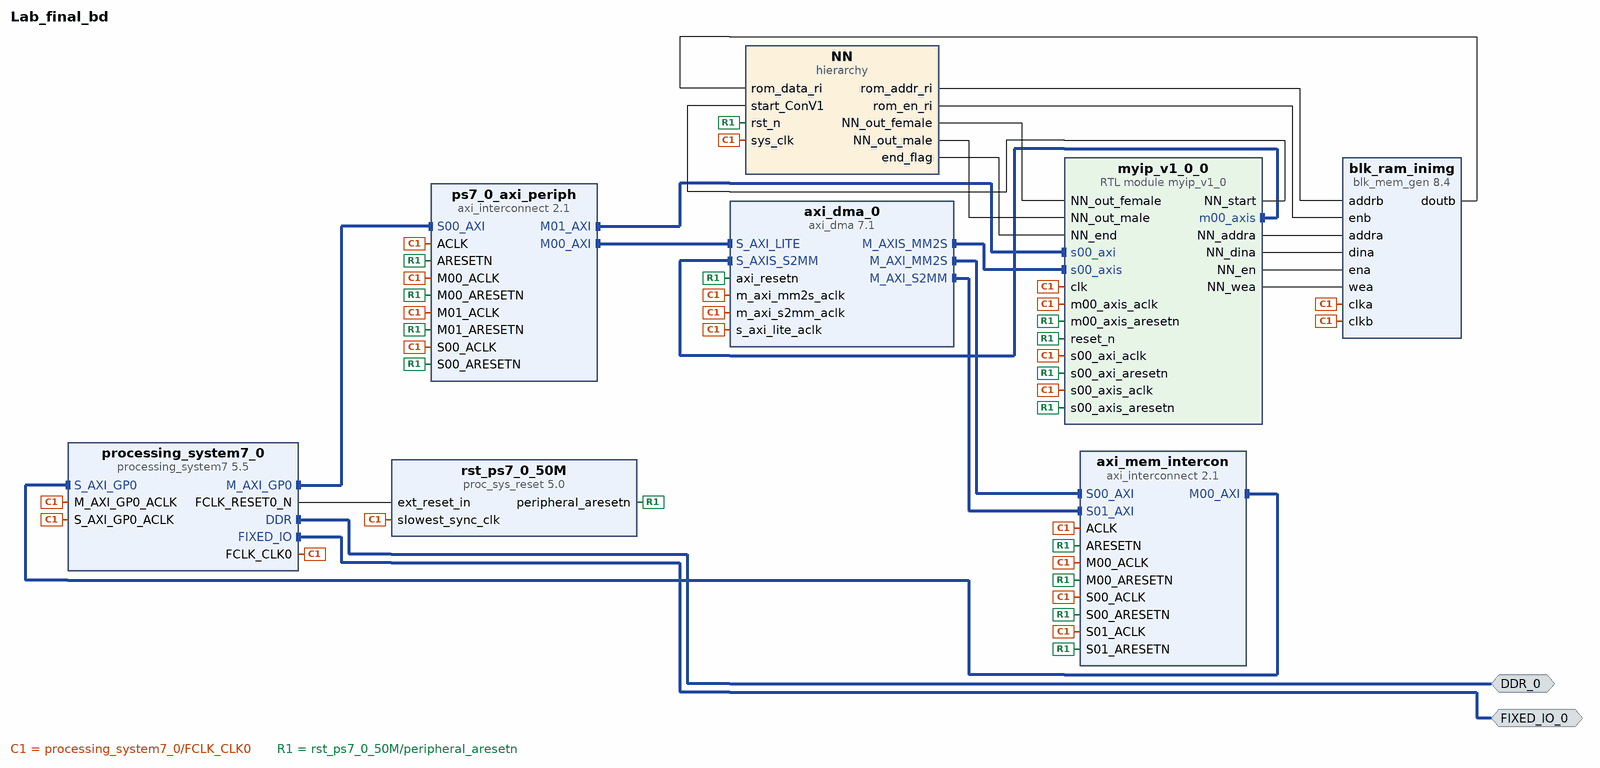
[diagram p0: block diagram of the top level]
# Vivado block design Lab_final_bd, xc7z020clg400-1, Vivado 2021.2
create_bd_design Lab_final_bd

create_bd_intf_port -mode Master -vlnv xilinx.com:interface:ddrx_rtl:1.0 DDR_0
create_bd_intf_port -mode Master -vlnv xilinx.com:display_processing_system7:fixedio_rtl:1.0 FIXED_IO_0

create_bd_cell -type ip -vlnv xilinx.com:ip:axi_dma:7.1 axi_dma_0
set_property -dict {CONFIG.c_include_sg 0} [get_bd_cells axi_dma_0]
create_bd_cell -type ip -vlnv xilinx.com:ip:axi_interconnect:2.1 axi_mem_intercon
set_property -dict {CONFIG.NUM_MI 1 CONFIG.NUM_SI 2} [get_bd_cells axi_mem_intercon]
create_bd_cell -type ip -vlnv xilinx.com:ip:blk_mem_gen:8.4 blk_ram_inimg
set_property -dict [list \
  CONFIG.Enable_32bit_Address false \
  CONFIG.Enable_A Use_ENA_Pin \
  CONFIG.Enable_B Use_ENB_Pin \
  CONFIG.Memory_Type Simple_Dual_Port_RAM \
  CONFIG.Operating_Mode_A NO_CHANGE \
  CONFIG.Port_B_Clock 100 \
  CONFIG.Port_B_Enable_Rate 100 \
  CONFIG.Read_Width_B 8 \
  CONFIG.Register_PortB_Output_of_Memory_Primitives true \
  CONFIG.Use_Byte_Write_Enable false \
  CONFIG.Write_Depth_A 4096 \
  CONFIG.Write_Width_A 8 \
  CONFIG.Write_Width_B 8 \
  CONFIG.use_bram_block Stand_Alone \
] [get_bd_cells blk_ram_inimg]
create_bd_cell -type module -reference myip_v1_0 myip_v1_0_0
create_bd_cell -type ip -vlnv xilinx.com:ip:processing_system7:5.5 processing_system7_0
set_property -dict [list \
  CONFIG.PCW_APU_PERIPHERAL_FREQMHZ 666.666666 \
  CONFIG.PCW_CRYSTAL_PERIPHERAL_FREQMHZ 33 \
  CONFIG.PCW_ENET0_PERIPHERAL_ENABLE 0 \
  CONFIG.PCW_FPGA0_PERIPHERAL_FREQMHZ 95 \
  CONFIG.PCW_FPGA1_PERIPHERAL_FREQMHZ 50 \
  CONFIG.PCW_GPIO_MIO_GPIO_ENABLE 0 \
  CONFIG.PCW_PERIPHERAL_BOARD_PRESET None \
  CONFIG.PCW_PRESET_BANK1_VOLTAGE {LVCMOS 1.8V} \
  CONFIG.PCW_QSPI_PERIPHERAL_ENABLE 0 \
  CONFIG.PCW_SD0_PERIPHERAL_ENABLE 0 \
  CONFIG.PCW_UART1_PERIPHERAL_ENABLE 0 \
  CONFIG.PCW_UIPARAM_DDR_FREQ_MHZ 533.333333 \
  CONFIG.PCW_UIPARAM_DDR_PARTNO {MT41J128M8 JP-125} \
  CONFIG.PCW_USB0_PERIPHERAL_ENABLE 0 \
  CONFIG.PCW_USE_S_AXI_GP0 1 \
] [get_bd_cells processing_system7_0]
# 333 more settings of processing_system7_0 are not shown: defaults, MIO pin electricals, DDR timing, and values the tool derives
create_bd_cell -type ip -vlnv xilinx.com:ip:axi_interconnect:2.1 ps7_0_axi_periph
set_property -dict {CONFIG.NUM_MI 2} [get_bd_cells ps7_0_axi_periph]
create_bd_cell -type ip -vlnv xilinx.com:ip:proc_sys_reset:5.0 rst_ps7_0_50M
create_bd_cell -type hier NN

# ---- hierarchy /NN ----
current_bd_instance /NN
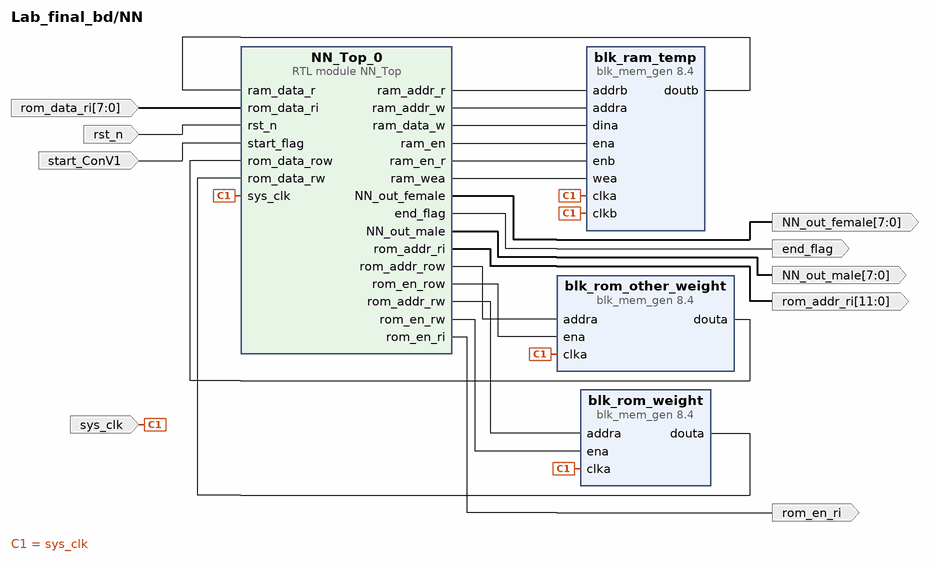
[diagram p1: block diagram inside /NN]
create_bd_pin -dir I start_ConV1
create_bd_pin -dir I sys_clk
create_bd_pin -dir I rst_n
create_bd_pin -dir O -from 7 -to 0 NN_out_male
create_bd_pin -dir O -from 7 -to 0 NN_out_female
create_bd_pin -dir I -from 7 -to 0 rom_data_ri
create_bd_pin -dir O -from 11 -to 0 rom_addr_ri
create_bd_pin -dir O rom_en_ri
create_bd_pin -dir O end_flag

create_bd_cell -type ip -vlnv xilinx.com:ip:blk_mem_gen:8.4 blk_ram_temp
set_property -dict [list \
  CONFIG.Enable_32bit_Address false \
  CONFIG.Enable_B Use_ENB_Pin \
  CONFIG.Memory_Type Simple_Dual_Port_RAM \
  CONFIG.Operating_Mode_A NO_CHANGE \
  CONFIG.Port_B_Clock 100 \
  CONFIG.Port_B_Enable_Rate 100 \
  CONFIG.Read_Width_B 8 \
  CONFIG.Register_PortB_Output_of_Memory_Primitives true \
  CONFIG.Use_Byte_Write_Enable false \
  CONFIG.Write_Depth_A 65536 \
  CONFIG.Write_Width_A 8 \
  CONFIG.Write_Width_B 8 \
  CONFIG.use_bram_block Stand_Alone \
] [get_bd_cells blk_ram_temp]
create_bd_cell -type ip -vlnv xilinx.com:ip:blk_mem_gen:8.4 blk_rom_other_weight
set_property -dict [list \
  CONFIG.Coe_File {../../../../../../../CNN_information/coe file/M0_bias.coe} \
  CONFIG.Enable_32bit_Address false \
  CONFIG.Load_Init_File true \
  CONFIG.Memory_Type Single_Port_ROM \
  CONFIG.Port_A_Write_Rate 0 \
  CONFIG.Register_PortA_Output_of_Memory_Primitives true \
  CONFIG.Use_RSTA_Pin false \
  CONFIG.Write_Depth_A 512 \
  CONFIG.use_bram_block Stand_Alone \
] [get_bd_cells blk_rom_other_weight]
create_bd_cell -type ip -vlnv xilinx.com:ip:blk_mem_gen:8.4 blk_rom_weight
set_property -dict [list \
  CONFIG.Coe_File {../../../../../../../CNN_information/coe file/weight.coe} \
  CONFIG.Enable_32bit_Address false \
  CONFIG.Load_Init_File true \
  CONFIG.Memory_Type Single_Port_ROM \
  CONFIG.Port_A_Write_Rate 0 \
  CONFIG.Register_PortA_Output_of_Memory_Primitives true \
  CONFIG.Use_RSTA_Pin false \
  CONFIG.Write_Depth_A 32768 \
  CONFIG.Write_Width_A 8 \
  CONFIG.use_bram_block Stand_Alone \
] [get_bd_cells blk_rom_weight]
create_bd_cell -type module -reference NN_Top NN_Top_0

# ---- connections ----

current_bd_instance /NN
connect_bd_net [get_bd_pins NN_Top_0/NN_out_female] [get_bd_pins NN_out_female]
connect_bd_net [get_bd_pins NN_Top_0/NN_out_male] [get_bd_pins NN_out_male]
connect_bd_net [get_bd_pins NN_Top_0/end_flag] [get_bd_pins end_flag]
connect_bd_net [get_bd_pins NN_Top_0/ram_addr_r] [get_bd_pins blk_ram_temp/addrb]
connect_bd_net [get_bd_pins NN_Top_0/ram_addr_w] [get_bd_pins blk_ram_temp/addra]
connect_bd_net [get_bd_pins NN_Top_0/ram_data_w] [get_bd_pins blk_ram_temp/dina]
connect_bd_net [get_bd_pins NN_Top_0/ram_en] [get_bd_pins blk_ram_temp/ena]
connect_bd_net [get_bd_pins NN_Top_0/ram_en_r] [get_bd_pins blk_ram_temp/enb]
connect_bd_net [get_bd_pins NN_Top_0/ram_wea] [get_bd_pins blk_ram_temp/wea]
connect_bd_net [get_bd_pins NN_Top_0/rom_addr_ri] [get_bd_pins rom_addr_ri]
connect_bd_net [get_bd_pins NN_Top_0/rom_addr_row] [get_bd_pins blk_rom_other_weight/addra]
connect_bd_net [get_bd_pins NN_Top_0/rom_addr_rw] [get_bd_pins blk_rom_weight/addra]
connect_bd_net [get_bd_pins NN_Top_0/rom_en_ri] [get_bd_pins rom_en_ri]
connect_bd_net [get_bd_pins NN_Top_0/rom_en_row] [get_bd_pins blk_rom_other_weight/ena]
connect_bd_net [get_bd_pins NN_Top_0/rom_en_rw] [get_bd_pins blk_rom_weight/ena]
connect_bd_net -net blk_ram_temp_value_doutb [get_bd_pins blk_ram_temp/doutb] [get_bd_pins NN_Top_0/ram_data_r]
connect_bd_net [get_bd_pins blk_rom_other_weight/douta] [get_bd_pins NN_Top_0/rom_data_row]
connect_bd_net [get_bd_pins blk_rom_weight/douta] [get_bd_pins NN_Top_0/rom_data_rw]
connect_bd_net [get_bd_pins rom_data_ri] [get_bd_pins NN_Top_0/rom_data_ri]
connect_bd_net [get_bd_pins rst_n] [get_bd_pins NN_Top_0/rst_n]
connect_bd_net -net start_ConV1_1 [get_bd_pins start_ConV1] [get_bd_pins NN_Top_0/start_flag]
connect_bd_net [get_bd_pins sys_clk] \
  [get_bd_pins blk_rom_other_weight/clka] [get_bd_pins blk_rom_weight/clka] [get_bd_pins blk_ram_temp/clka] \
  [get_bd_pins blk_ram_temp/clkb] [get_bd_pins NN_Top_0/sys_clk]

current_bd_instance /
connect_bd_intf_net [get_bd_intf_pins axi_dma_0/M_AXIS_MM2S] [get_bd_intf_pins myip_v1_0_0/s00_axis]
connect_bd_intf_net [get_bd_intf_pins axi_dma_0/M_AXI_MM2S] [get_bd_intf_pins axi_mem_intercon/S00_AXI]
connect_bd_intf_net [get_bd_intf_pins axi_dma_0/M_AXI_S2MM] [get_bd_intf_pins axi_mem_intercon/S01_AXI]
connect_bd_intf_net [get_bd_intf_pins axi_mem_intercon/M00_AXI] [get_bd_intf_pins processing_system7_0/S_AXI_GP0]
connect_bd_intf_net [get_bd_intf_pins axi_dma_0/S_AXIS_S2MM] [get_bd_intf_pins myip_v1_0_0/m00_axis]
connect_bd_intf_net [get_bd_intf_ports DDR_0] [get_bd_intf_pins processing_system7_0/DDR]
connect_bd_intf_net [get_bd_intf_ports FIXED_IO_0] [get_bd_intf_pins processing_system7_0/FIXED_IO]
connect_bd_intf_net [get_bd_intf_pins processing_system7_0/M_AXI_GP0] [get_bd_intf_pins ps7_0_axi_periph/S00_AXI]
connect_bd_intf_net [get_bd_intf_pins axi_dma_0/S_AXI_LITE] [get_bd_intf_pins ps7_0_axi_periph/M00_AXI]
connect_bd_intf_net [get_bd_intf_pins myip_v1_0_0/s00_axi] [get_bd_intf_pins ps7_0_axi_periph/M01_AXI]
connect_bd_net [get_bd_pins NN/NN_out_female] [get_bd_pins myip_v1_0_0/NN_out_female]
connect_bd_net [get_bd_pins NN/NN_out_male] [get_bd_pins myip_v1_0_0/NN_out_male]
connect_bd_net [get_bd_pins NN/end_flag] [get_bd_pins myip_v1_0_0/NN_end]
connect_bd_net [get_bd_pins NN/rom_addr_ri] [get_bd_pins blk_ram_inimg/addrb]
connect_bd_net [get_bd_pins NN/rom_en_ri] [get_bd_pins blk_ram_inimg/enb]
connect_bd_net [get_bd_pins myip_v1_0_0/NN_addra] [get_bd_pins blk_ram_inimg/addra]
connect_bd_net [get_bd_pins myip_v1_0_0/NN_dina] [get_bd_pins blk_ram_inimg/dina]
connect_bd_net [get_bd_pins myip_v1_0_0/NN_en] [get_bd_pins blk_ram_inimg/ena]
connect_bd_net [get_bd_pins myip_v1_0_0/NN_wea] [get_bd_pins blk_ram_inimg/wea]
connect_bd_net [get_bd_pins processing_system7_0/FCLK_CLK0] \
  [get_bd_pins axi_dma_0/m_axi_mm2s_aclk] [get_bd_pins axi_dma_0/m_axi_s2mm_aclk] [get_bd_pins axi_dma_0/s_axi_lite_aclk] \
  [get_bd_pins axi_mem_intercon/ACLK] [get_bd_pins axi_mem_intercon/M00_ACLK] [get_bd_pins axi_mem_intercon/S00_ACLK] \
  [get_bd_pins axi_mem_intercon/S01_ACLK] [get_bd_pins blk_ram_inimg/clka] [get_bd_pins blk_ram_inimg/clkb] \
  [get_bd_pins myip_v1_0_0/clk] [get_bd_pins myip_v1_0_0/m00_axis_aclk] [get_bd_pins myip_v1_0_0/s00_axi_aclk] \
  [get_bd_pins myip_v1_0_0/s00_axis_aclk] [get_bd_pins processing_system7_0/M_AXI_GP0_ACLK] \
  [get_bd_pins processing_system7_0/S_AXI_GP0_ACLK] [get_bd_pins ps7_0_axi_periph/ACLK] \
  [get_bd_pins ps7_0_axi_periph/M00_ACLK] [get_bd_pins ps7_0_axi_periph/M01_ACLK] [get_bd_pins ps7_0_axi_periph/S00_ACLK] \
  [get_bd_pins rst_ps7_0_50M/slowest_sync_clk] [get_bd_pins NN/sys_clk]
connect_bd_net [get_bd_pins processing_system7_0/FCLK_RESET0_N] [get_bd_pins rst_ps7_0_50M/ext_reset_in]
connect_bd_net -net rom_data_ri_1 [get_bd_pins blk_ram_inimg/doutb] [get_bd_pins NN/rom_data_ri]
connect_bd_net [get_bd_pins rst_ps7_0_50M/peripheral_aresetn] \
  [get_bd_pins axi_dma_0/axi_resetn] [get_bd_pins axi_mem_intercon/ARESETN] [get_bd_pins axi_mem_intercon/M00_ARESETN] \
  [get_bd_pins axi_mem_intercon/S00_ARESETN] [get_bd_pins axi_mem_intercon/S01_ARESETN] \
  [get_bd_pins myip_v1_0_0/m00_axis_aresetn] [get_bd_pins myip_v1_0_0/reset_n] [get_bd_pins myip_v1_0_0/s00_axi_aresetn] \
  [get_bd_pins myip_v1_0_0/s00_axis_aresetn] [get_bd_pins ps7_0_axi_periph/ARESETN] \
  [get_bd_pins ps7_0_axi_periph/M00_ARESETN] [get_bd_pins ps7_0_axi_periph/M01_ARESETN] \
  [get_bd_pins ps7_0_axi_periph/S00_ARESETN] [get_bd_pins NN/rst_n]
connect_bd_net -net start_ConV1_1 [get_bd_pins myip_v1_0_0/NN_start] [get_bd_pins NN/start_ConV1]

# ---- address map ----
assign_bd_address -offset 0x00000000 -range 512M -target_address_space [get_bd_addr_spaces axi_dma_0/Data_MM2S] [get_bd_addr_segs processing_system7_0/S_AXI_GP0/GP0_DDR_LOWOCM]
exclude_bd_addr_seg -offset 0x40000000 -range 1G -target_address_space [get_bd_addr_spaces axi_dma_0/Data_MM2S] [get_bd_addr_segs processing_system7_0/S_AXI_GP0/GP0_M_AXI_GP0]
assign_bd_address -offset 0x00000000 -range 512M -target_address_space [get_bd_addr_spaces axi_dma_0/Data_S2MM] [get_bd_addr_segs processing_system7_0/S_AXI_GP0/GP0_DDR_LOWOCM]
exclude_bd_addr_seg -offset 0x40000000 -range 1G -target_address_space [get_bd_addr_spaces axi_dma_0/Data_S2MM] [get_bd_addr_segs processing_system7_0/S_AXI_GP0/GP0_M_AXI_GP0]
assign_bd_address -offset 0x40400000 -range 64K -target_address_space [get_bd_addr_spaces processing_system7_0/Data] [get_bd_addr_segs axi_dma_0/S_AXI_LITE/Reg]
assign_bd_address -offset 0x43C00000 -range 64K -target_address_space [get_bd_addr_spaces processing_system7_0/Data] [get_bd_addr_segs myip_v1_0_0/s00_axi/reg0]

validate_bd_design
save_bd_design
